# EAGLE design followLineMain (EAGLE 7.7.0)
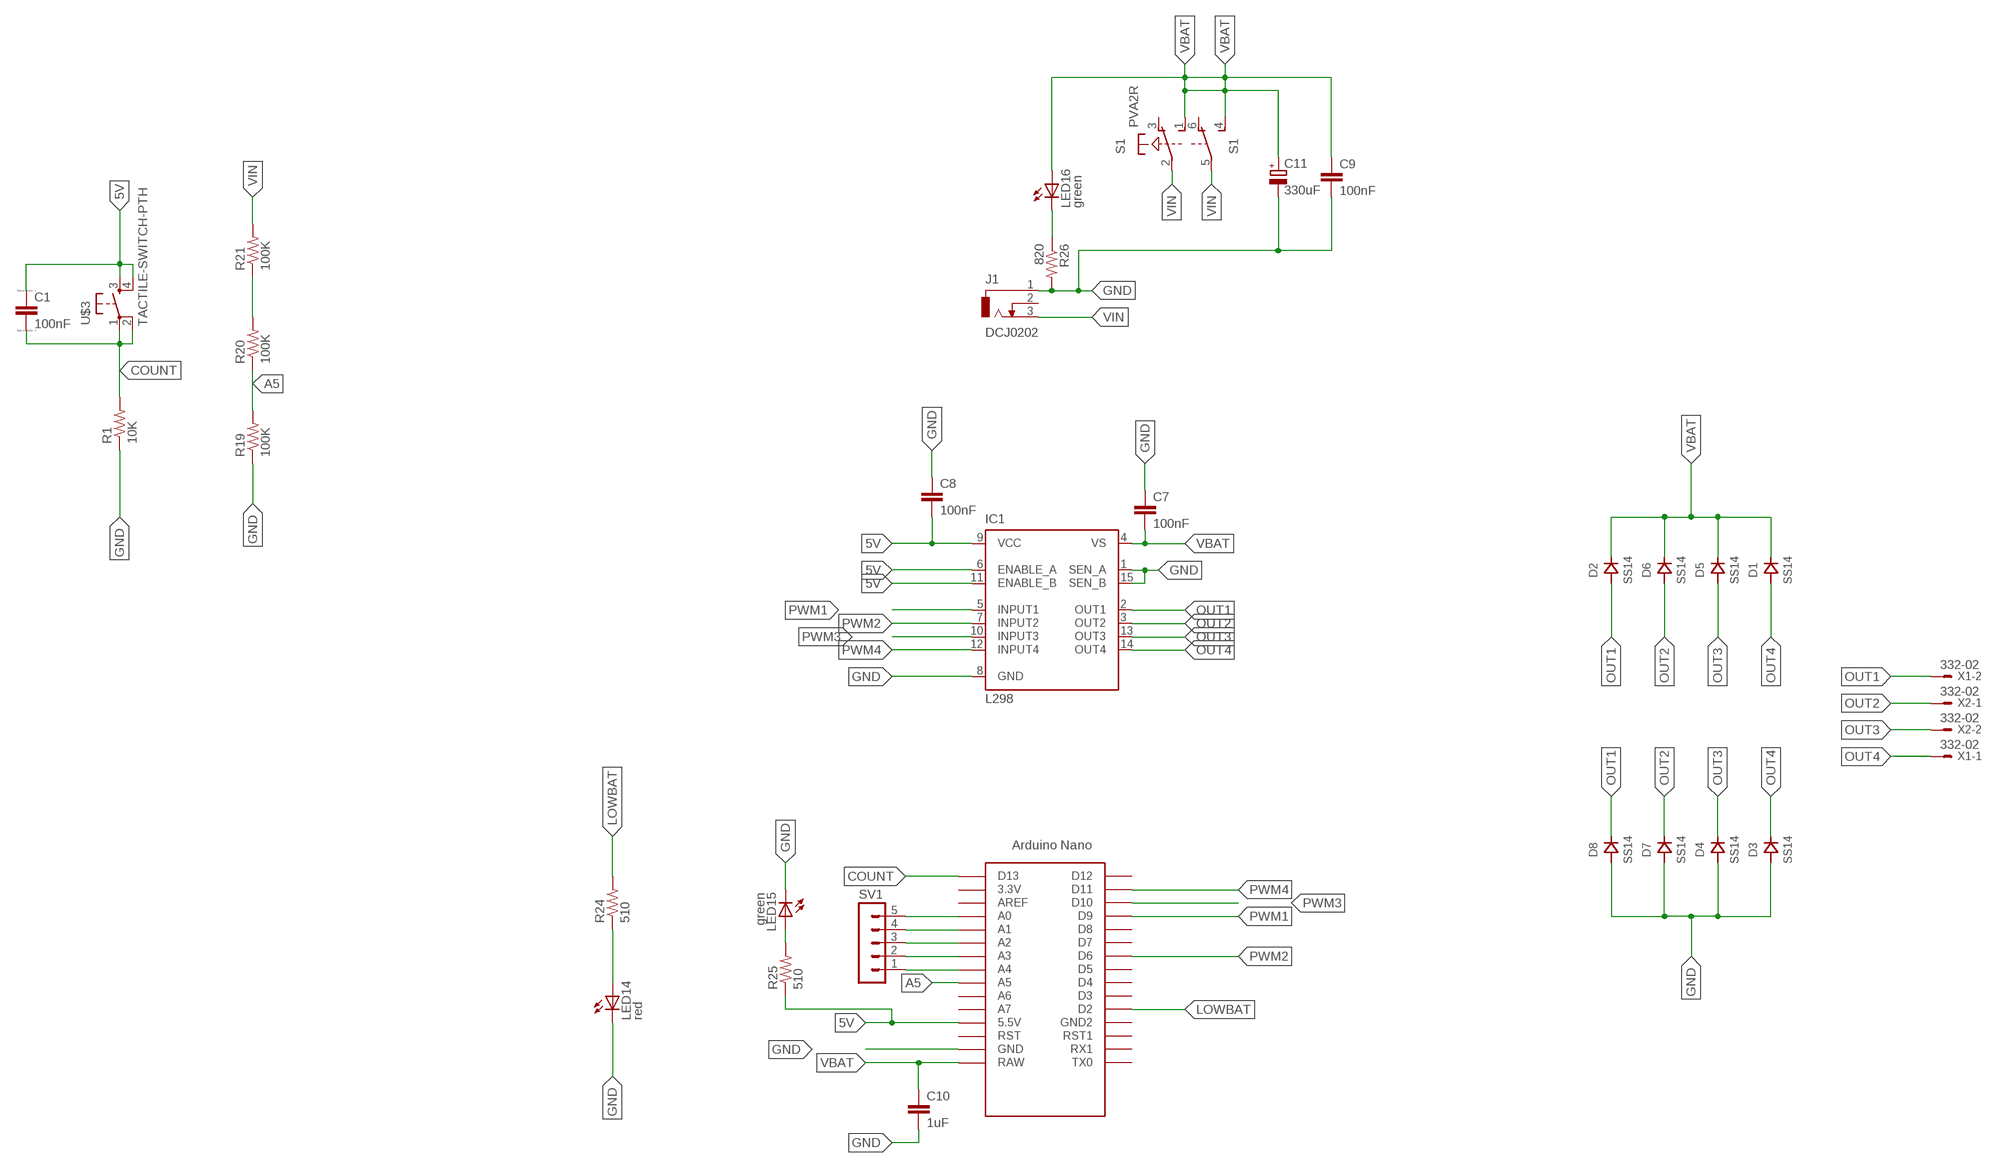
[diagram p0: schematic, sheet 1]

## Parts
C1  100nF  CC0603  [C0603]
C7  100nF  CAP0805  [0805]
C8  100nF  CAP0805  [0805]
C9  100nF  CAP0805  [0805]
C10  1uF  CAP1206  [1206]
C11  330uF  CPOL-EUE5-13  [E5-13]
D1  SS14  [DO214]
D2  SS14  [DO214]
D3  SS14  [DO214]
D4  SS14  [DO214]
D5  SS14  [DO214]
D6  SS14  [DO214]
D7  SS14  [DO214]
D8  SS14  [DO214]
IC1  L298  [MULTIWATT-15]
J1  DCJ0202  [DCJ0202]
LED14  red  LEDSML0805  [SML0805]
LED15  green  LEDSML0805  [SML0805]
LED16  green  LEDSML0805  [SML0805]
R1  10K  RESISTOR0805-RES  [0805]
R19  100K  RESISTOR0805-RES  [0805]
R20  100K  RESISTOR0805-RES  [0805]
R21  100K  RESISTOR0805-RES  [0805]
R24  510  RESISTOR0805-RES  [0805]
R25  510  RESISTOR0805-RES  [0805]
R26  820  RESISTOR0805-RES  [0805]
S1  PVA2R  [PVA2R]
SV1  MA05-1  [MA05-1]
U$1  NANO  [NANO]
U$3  TACTILE-SWITCH-PTH  [TAC-SWITCH-PTH]
X1  332-02  [332-02]
X2  332-02  [332-02]

## Nets
5V: C1.1 C8.2 IC1.6(ENABLE_A) IC1.9(VCC) IC1.11(ENABLE_B) R25.1 U$1.5V(5.5V) U$3.3 U$3.4
A5: R19.2 R20.1 U$1.A5
COUNT: C1.2 R1.2 U$1.D13 U$3.1 U$3.2
GND: C7.1 C8.1 C9.2 C10.2 C11.- D3.ANODE D4.ANODE D7.ANODE D8.ANODE IC1.1(SEN_A) IC1.8(GND) IC1.15(SEN_B) J1.1 LED14.C LED15.C R1.1 R19.1 R26.2 U$1.GND
LOWBAT: R24.2 U$1.D2
N$1: LED16.C R26.1
N$2: LED14.A R24.1
N$3: SV1.1 U$1.A4
N$4: SV1.2 U$1.A3
N$5: R20.2 R21.1
N$6: SV1.3 U$1.A2
N$7: SV1.4 U$1.A1
N$8: SV1.5 U$1.A0
N$9: LED15.A R25.2
OUT1: D2.ANODE D8.CATHODE IC1.2(OUT1) X1.2
OUT2: D6.ANODE D7.CATHODE IC1.3(OUT2) X2.1
OUT3: D4.CATHODE D5.ANODE IC1.13(OUT3) X2.2
OUT4: D1.ANODE D3.CATHODE IC1.14(OUT4) X1.1
PWM1: IC1.5(INPUT1) U$1.D9
PWM2: IC1.7(INPUT2) U$1.D6
PWM3: IC1.10(INPUT3) U$1.D10
PWM4: IC1.12(INPUT4) U$1.D11
VBAT: C7.2 C9.1 C10.1 C11.+ D1.CATHODE D2.CATHODE D5.CATHODE D6.CATHODE IC1.4(VS) LED16.A S1.1(1:S) S1.4(2:S) U$1.RAW
VIN: J1.3 R21.2 S1.2(1:P) S1.5(2:P)
Unconnected: J1.2 S1.3(1:O) S1.6(2:O) U$1.3.3V U$1.A6 U$1.A7 U$1.AREF U$1.D3 U$1.D4 U$1.D5 U$1.D7 U$1.D8 U$1.D12 U$1.GND1(GND2) U$1.ICSP1 U$1.ICSP2 U$1.ICSP3 U$1.ICSP4 U$1.ICSP5 U$1.ICSP6 U$1.RST U$1.RST1 U$1.RX1 U$1.TX0

## Library data of the parts
C1 = eagle-ltspice:C: CAPACITOR, European symbol; SPICEMODEL: NONE; SPICEPREFIX: C
C7-C10 = SparkFun-Capacitors:CAP: Capacitor Standard 0603 ceramic capacitor, and 0.1" leaded capacitor.
C11 = rcl:CPOL-EU: POLARIZED CAPACITOR, European symbol
D1-D8 = ihpcb-diode:SS14
IC1 = st-microelectronics:L298: DUAL FULL-BRIDGE DRIVER; MPN: L298N; OC_FARNELL: 1589425; OC_NEWARK: 32M1527
J1 = con-jack:DCJ0202: DC POWER JACK Source: DCJ0202.pdf; OC_FARNELL: unknown; OC_NEWARK: unknown
LED14-LED16 = led:LED: LED OSRAM: - CHIPLED LG R971, LG N971, LY N971, LG Q971, LY Q971, LO R971, LY R971 LH N974, LH R974 LS Q976, LO Q976, LY Q976 LO Q996 - Hyper CHIPLED LW Q18S LB Q993, LB Q99A, LB R99A - SideLED LS A670, LO A670, LY A670, LG A670, LP A670 LB A673, LV A673, LT A673, LW A673 LH A674 LY A675 LS A676, LA A676, LO A676, LY A676, LW A676 LS A679, LY A679, LG A679 - Hyper Micro SIDELED® LS Y876, LA Y876, LO Y876, LY Y876 LT Y87S - SmartLED LW L88C, LW L88S LB L89C, LB L89S, LG L890 LS L89K, LO L89K, LY L89K LS L896, LA L896, LO L896, LY L896 - TOPLED LS T670, LO T670, LY T670, LG T670, LP T670 LSG T670, LSP T670, LSY T670, LOP T670, LYG T670 LG T671, LOG T671, LSG T671 LB T673, LV T673, LT T673, LW T673 LH T674 LS T676, LA T676, LO T676, LY T676, LB T676, LH T676, LSB T676, LW T676 LB T67C, LV T67C, LT T67C, LS T67K, LO T67K, LY T67K, LW E67C LS E67B, LA E67B, LO E67B, LY E67B, LB E67C, LV E67C, LT E67C LW T67C LS T679, LY T679, LG T679 LS T770, LO T770, LY T770, LG T770, LP T770 LB T773, LV T773, LT T773, LW T773 LH T774 LS E675, LA E675, LY E675, LS T675 LS T776, LA T776, LO T776, LY T776, LB T776 LHGB T686 LT T68C, LB T68C - Hyper Mini TOPLED® LB M676 - Mini TOPLED Santana® LG M470 LS M47K, LO M47K, LY M47K Source: http://www.osram.convergy.de LUXEON: - LUMILED® LXK2-PW12-R00, LXK2-PW12-S00, LXK2-PW14-U00, LXK2-PW14-V00 LXK2-PM12-R00, LXK2-PM12-S00, LXK2-PM14-U00 LXK2-PE12-Q00, LXK2-PE12-R00, LXK2-PE12-S00, LXK2-PE14-T00, LXK2-PE14-U00 LXK2-PB12-K00, LXK2-PB12-L00, LXK2-PB12-M00, LXK2-PB14-N00, LXK2-PB14-P00, LXK2-PB14-Q00 LXK2-PR12-L00, LXK2-PR12-M00, LXK2-PR14-Q00, LXK2-PR14-R00 LXK2-PD12-Q00, LXK2-PD12-R00, LXK2-PD12-S00 LXK2-PH12-R00, LXK2-PH12-S00 LXK2-PL12-P00, LXK2-PL12-Q00, LXK2-PL12-R00 Source: www.luxeon.com KINGBRIGHT: KA-3528ASYC Source: www.kingbright.com
R1 R19-R21 R24-R26 = SparkFun-Passives:RESISTOR: Resistor Basic schematic elements and footprints for 0603, 1206, and PTH resistors.
S1 = switch-misc:PVA2R: ITT SWITCH
SV1 = con-lstb:MA05-1: PIN HEADER; OC_FARNELL: unknown; OC_NEWARK: unknown
U$1 = Arduino-clone:NANO: Arduino Nano
U$3 = GeekAmmo:TACTILE-SWITCH: Tactile Switch 4 Pins, SPST NO
X1 X2 = con-garry:332-02: 2 Pin - 2mm Dual Row Source: www.mpe-connector.de / garry_shortform_2012.pdf

## Board
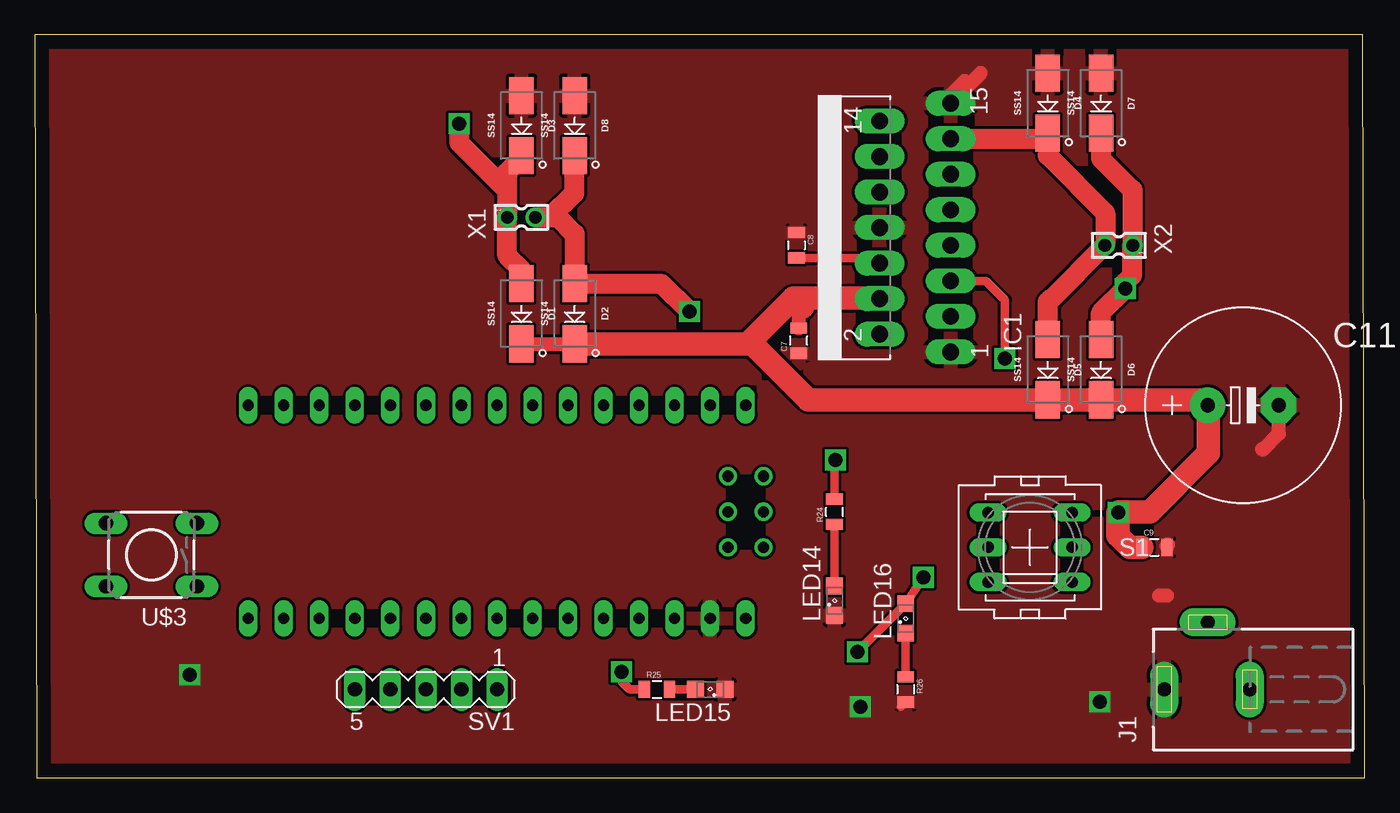
[diagram p1: board, top side]
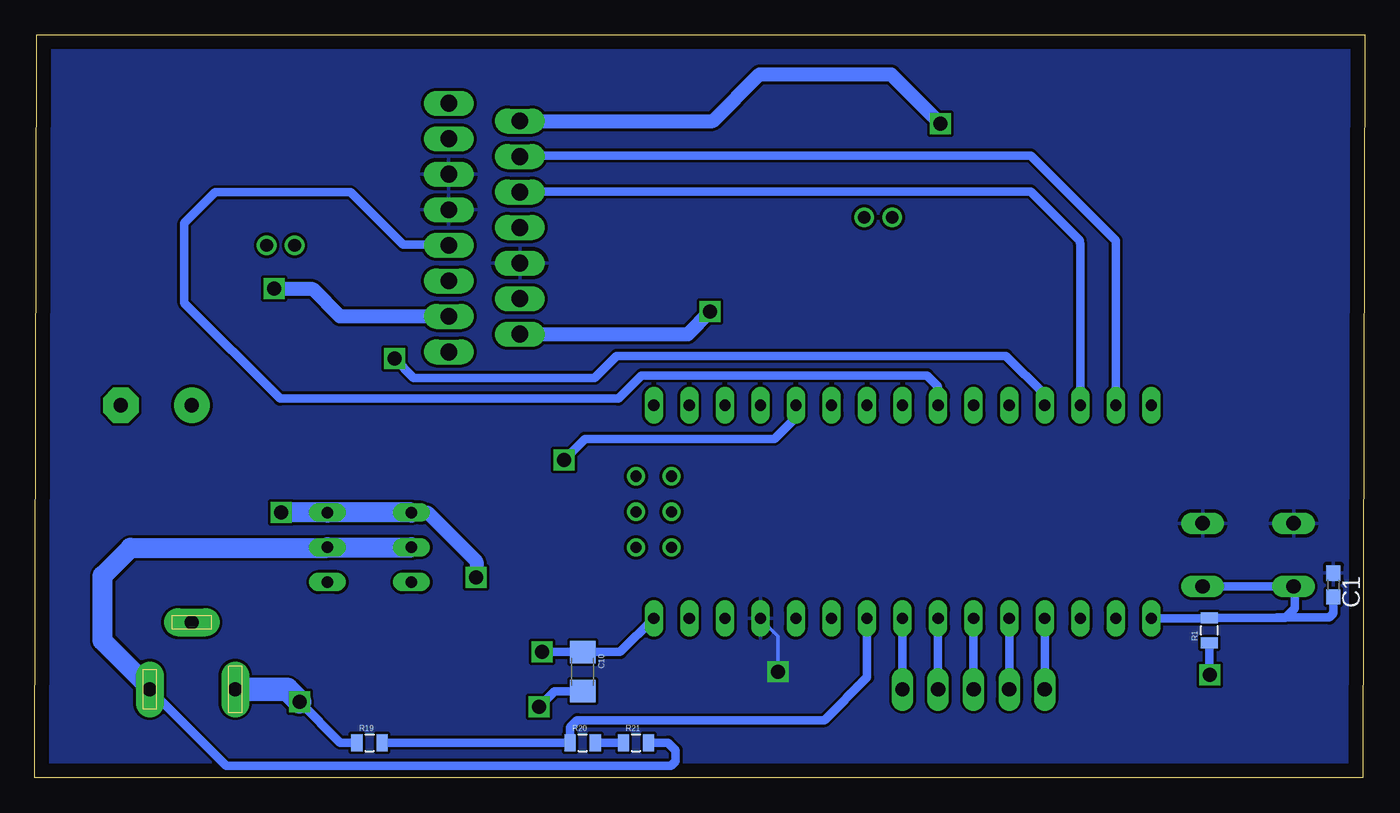
[diagram p2: board, bottom side, seen from below]

Size 95.03 x 53.11 mm. Coordinates in mm from the lower left corner, seen from the top.
Outline: 0.11,0 95.03,0 94.92,53.11 0,53.11 0.11,0
Copper layers (1*16): Top 0.035mm / dielectric 1.5mm / Bottom 0.035mm
Design rules "default": minimum track width 10mil, minimum drill 24mil, track to track 8mil, track to pad 8mil, pad to pad 8mil, via to via 8mil, smd to smd 8mil, copper to edge 40mil, drill to drill 8mil, minimum pad ring 10mil, minimum via ring 8mil, stop-mask expansion 4mil, vias tented up to drill 0mil, thermal gap 10mil

### Footprints (pad centres in the part's own frame; a part is rotated, then mirrored left to right if it is on the bottom)
C0603 = smd 1.1 x 1: 1 -0.85,0; 2 0.85,0
0805 = smd 0.8 x 1.2: 1 -0.9,0; 2 0.9,0
1206 = smd 1.6 x 1.8: 1 -1.4,0; 2 1.4,0
E5-13 = drill 1.016 pad 2.54: + -2.54,0 | drill 1.016 pad 2.54 octagon: - 2.54,0
DO214 = smd 2.65 x 1.75: ANODE -2.15,0; CATHODE 2.15,0
MULTIWATT-15 = drill 1.2 long: 1 -8.89,-7.62; 2 -7.62,-2.54; 3 -6.35,-7.62; 4 -5.08,-2.54; 5 -3.81,-7.62; 6 -2.54,-2.54; 7 -1.27,-7.62; 8 0,-2.54; 9 1.27,-7.62; 10 2.54,-2.54; 11 3.81,-7.62; 12 5.08,-2.54; 13 6.35,-7.62; 14 7.62,-2.54; 15 8.89,-7.62
DCJ0202 = drill 1 pad 2 long: 1 0,3.1; 2 4.8,0; 3 0,-3
SML0805 = smd 1.2 x 1.2: A 1.05,0; C -1.05,0
PVA2R = drill 0.813 long: 1 -2.997,2.489; 2 -2.997,0; 3 -2.997,-2.489; 4 2.997,2.489; 5 2.997,0; 6 2.997,-2.489
MA05-1 = drill 1.016 long: 1 -5.08,0; 2 -2.54,0; 3 0,0; 4 2.54,0; 5 5.08,0
NANO = drill 0.8 long: 3.3V -10.16,24.13; 5V -10.16,-1.27; A0 -10.16,19.05; A1 -10.16,16.51; A2 -10.16,13.97; A3 -10.16,11.43; A4 -10.16,8.89; A5 -10.16,6.35; A6 -10.16,3.81; A7 -10.16,1.27; AREF -10.16,21.59; D2 5.08,1.27; D3 5.08,3.81; D4 5.08,6.35; D5 5.08,8.89; D6 5.08,11.43; D7 5.08,13.97; D8 5.08,16.51; D9 5.08,19.05; D10 5.08,21.59; D11 5.08,24.13; D12 5.08,26.67; D13 -10.16,26.67; GND -10.16,-6.35; GND1 5.08,-1.27; RAW -10.16,-8.89; RST -10.16,-3.81; RST1 5.08,-3.81; RX1 5.08,-6.35; TX0 5.08,-8.89 | drill 0.8: ICSP1 -5.08,-10.16; ICSP2 -5.08,-7.62; ICSP3 -2.54,-10.16; ICSP4 -2.54,-7.62; ICSP5 0,-10.16; ICSP6 0,-7.62
TAC-SWITCH-PTH = drill 1.016 pad 1.524 long: 1 -3.251,2.261; 2 3.251,2.261; 3 -3.251,-2.261; 4 3.251,-2.261
332-02 = drill 0.9 pad 1.27: 1 0,-1; 2 0,1

### Placement (x,y rotation side)
C1  2.22,13.79 270 bottom
C7  54.59,31.25 90 top
C8  54.43,38.07 270 top
C9  80.01,16.48 0 top
C10  55.88,7.59 270 bottom
C11  86.36,26.64 0 top
D1  34.77,33.18 270 top
D2  38.58,33.18 270 top
D3  34.77,46.63 270 top
D4  72.39,48.23 270 top
D5  72.39,29.18 270 top
D6  76.2,29.18 270 top
D7  76.2,48.23 270 top
D8  38.58,46.63 270 top
IC1  57.83,39.34 90 top
J1  83.82,6.32 90 top
LED14  57.15,12.67 90 top
LED15  48.26,6.32 180 top
LED16  62.23,11.4 90 top
R1  11.1,10.54 90 bottom
R19  71.12,2.51 0 bottom
R20  55.88,2.51 0 bottom
R21  52.07,2.51 0 bottom
R24  57.15,19.02 90 top
R25  44.45,6.32 0 top
R26  62.23,6.32 270 top
S1  71.12,16.48 0 top
SV1  27.94,6.32 180 top
U$1  41.91,21.56 90 top
U$3  8.32,15.94 180 top
X1  34.77,40.07 270 top
X2  77.47,38.07 90 top

### Tracks (layer width: path | path; a pad name or v marks a point on that pad's centre or on a via)
5V  (via drill 1)
  Top 0.61: 54.32,37.17 C8.2 60,37.17 IC1.6 | v41.91,7.59 41.91,6.91 42.5,6.32 R25.1
  Bottom 0.254: v41.91,7.59 41.91,10.13 U$1.5V
  pour Bottom: 0.44,52.61 94.52,52.61 94.74,-0.15 0.66,-0.15
A5
  Bottom 0.61: R19.2 R20.1 56.78,3.63 56.28,4.13 38.6,4.13 35.56,7.17 U$1.A5
COUNT
  Bottom 0.61: U$1.D13 11.14,11.4 R1.2 6.28,11.45 | U$3.2 U$3.1 4.99,13.68 4.97,13.7 4.97,12.13 5.65,11.45 6.28,11.45 | C1.2 2.22,11.76 2.51,11.47 6.26,11.47 6.28,11.45
GND  (via drill 1)
  Top 0.61: 49.53,6.1 LED15.C | 61.9,5.09 R26.2
  Top 1.016: C9.2 80.91,16.68 80.99,16.68 | 80.92,13.01 80.36,13.01 | D7.ANODE | 67.6,50.38 IC1.15 65.45,48.82 66.44,49.81 | 87.72,23.49 87.8,23.49 88.92,24.61 88.92,26.62 C11.-
  Bottom 0.61: R19.1 73.21,2.51 v76.12,5.42 | C10.2 57.9,6.19 v59,5.09 | R1.1 11.1,7.41 v11.06,7.37
  Bottom 1.676: J1.1 77.02,6.32 v76.12,5.42
  pour Top: 0.76,52.13 94.2,52.13 94.2,0.77 0.76,0.77
LOWBAT  (via drill 1)
  Top 0.61: R24.2 57.15,22.64 v57.23,22.72
  Bottom 0.61: U$1.D2 40.64,25.77 42.18,24.23 55.72,24.23 v57.23,22.72
N$1
  Top 0.61: LED16.C R26.1
N$2
  Top 0.61: LED14.A R24.1
N$3
  Bottom 0.61: SV1.1 U$1.A4
N$4
  Bottom 0.61: SV1.2 U$1.A3
N$5
  Bottom 0.61: R21.1 R20.2
N$6
  Bottom 0.61: SV1.3 U$1.A2
N$7
  Bottom 0.61: SV1.4 U$1.A1
N$8
  Bottom 0.61: SV1.5 U$1.A0
N$9
  Top 0.61: R25.2 LED15.A
OUT1  (via drill 1)
  Top 1.016: 38.6,44.46 D8.CATHODE
  Top 1.422: X1.2 36.83,40.07 | 36.83,40.07 38.55,41.79 38.55,44.45 D8.CATHODE | 36.83,40.07 37.39,40.07 38.58,38.88 D2.ANODE 44.76,35.33 v46.78,33.32
  Bottom 1.016: IC1.2 48.37,31.72 v46.78,33.32
OUT2  (via drill 1)
  Top 1.016: v77.92,34.97 77.92,35.37 | 78.44,38.04 X2.1 78.44,38.1 | D7.CATHODE 76.2,44.77
  Top 1.422: D6.ANODE 76.2,33.25 v77.92,34.97 | 77.92,35.37 77.92,35.44 78.42,35.94 78.42,38.02 X2.1 78.45,38.09 78.45,42.02 76.2,44.27 76.2,44.77
  Bottom 1.016: IC1.3 73.22,32.99 75.16,34.93 77.88,34.93 v77.92,34.97
OUT3
  Top 1.016: 76.44,38.1 X2.2
  Top 1.422: IC1.13 72,45.69 D4.CATHODE 72.39,44.5 76.5,40.39 76.5,38.1 X2.2 72.6,34.2 72.56,34.2 72.39,34.03 D5.ANODE
OUT4  (via drill 1)
  Top 0.813: 33.92,39.92 X1.1 33.92,40.22
  Top 1.016: 33.8,40.04 X1.1
  Top 1.422: v30.32,46.77 30.32,45.42 33.75,41.99 33.75,40.09 X1.1 | D3.CATHODE 34.77,44.34 33.73,43.3 33.73,40.11 X1.1 | D1.ANODE 34.77,36.32 33.75,37.34 33.75,40.05 X1.1
  Bottom 1.016: IC1.14 46.57,46.96 43.24,50.29 33.84,50.29 v30.32,46.77
PWM1  (via drill 1)
  Top 0.61: v69.34,29.98 69.34,34.16 67.97,35.53 IC1.5
  Bottom 0.61: U$1.D9 22.86,27.4 25.63,30.17 53.46,30.17 55.03,28.6 67.96,28.6 v69.34,29.98
PWM2
  Bottom 0.61: U$1.D6 30.48,27.98 31.27,28.77 51.67,28.77 53.33,27.11 77.51,27.11 84.36,33.96 84.36,39.65 82.14,41.87 72.47,41.87 68.71,38.11 65.49,38.11 IC1.7
PWM3
  Bottom 0.61: U$1.D10 20.32,38.2 20.35,38.23 20.35,38.41 23.86,41.92 60.33,41.92 IC1.10
PWM4
  Bottom 0.61: U$1.D11 17.78,38.41 23.86,44.49 60.3,44.49 IC1.12
VBAT  (via drill 1)
  Top 0.61: v58.77,8.99 LED16.A v63.5,14.35
  Top 0.813: D5.CATHODE 72.92,27.03 72.86,26.97 | 77.47,19.02 v77.42,18.97
  Top 1.016: 77.4,18.95 v77.42,18.97 | 83.8,26.62 C11.+ | 60.32,34.21 IC1.4 | D1.CATHODE D2.CATHODE | C7.2 54.59,33.32 54.84,33.57 54.84,33.65 55.48,34.29
  Top 1.676: C9.1 78.25,16.48 77.4,17.33 77.4,18.95 | D2.CATHODE 50.95,31.03 51.12,31.2 | 51.12,31.2 54.21,34.29 54.71,34.29 | 54.71,34.29 60.34,34.29 IC1.4 | 54.84,33.65 54.84,34.16 54.71,34.29 | 51.12,31.2 55.29,27.03 D5.CATHODE D6.CATHODE 83.43,27.03 C11.+ 83.88,26.58 83.88,23.22 79.68,19.02 77.47,19.02
  Bottom 0.61: v58.77,8.99 C10.1 53.21,8.99 U$1.RAW
  Bottom 0.813: v77.42,18.97 77.47,19.02
  Bottom 1.016: S1.1 66.98,18.97 63.48,15.47 63.48,14.37 v63.5,14.35
  Bottom 1.422: S1.1 S1.4 v77.42,18.97
VIN
  Bottom 0.254: R21.2 51.17,2.14
  Bottom 0.61: J1.3 81.35,0.85 49.56,0.85 49.24,1.17 49.24,1.97 49.78,2.51 R21.2
  Bottom 1.016: J1.3 86.82,6.43
  Bottom 1.422: 86.82,6.43 90.2,9.81 90.2,14.45 88.2,16.45 74.15,16.45 S1.5 S1.2